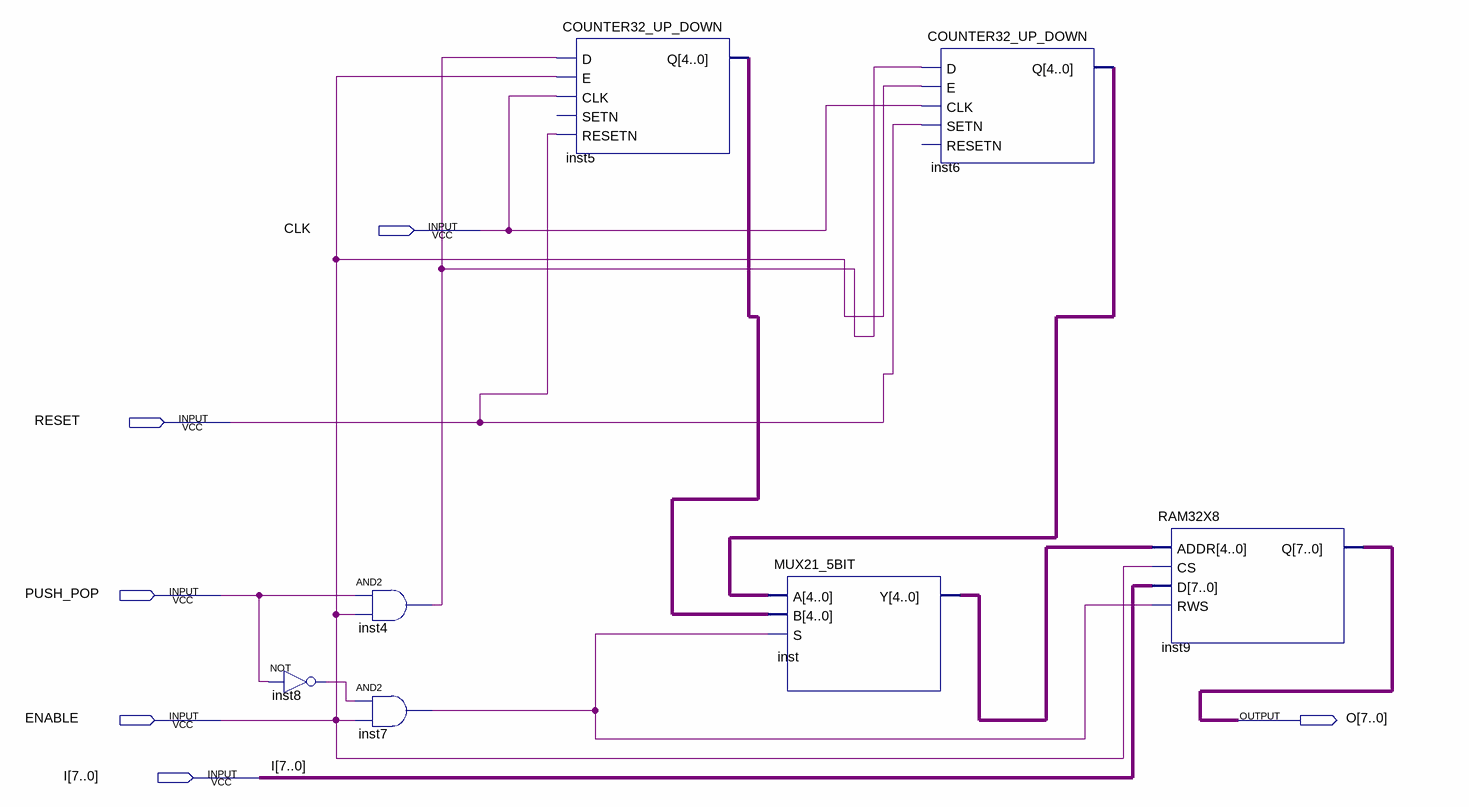
[diagram p0: schematic sheet]
// Quartus schematic STACK_FINAL.bdf as structural Verilog: 7 symbols, 6 pins
module STACK_FINAL (
  input  CLK,
  input  RESET,
  input  PUSH_POP,
  input  ENABLE,
  input  [7:0] I,
  output [7:0] O
);

  wire inst4_out, inst7_out, inst8_out;
  wire [4:0] inst5_q, inst6_q, inst_y;

  not inst8 (inst8_out, PUSH_POP);
  and inst4 (inst4_out, PUSH_POP, ENABLE);
  and inst7 (inst7_out, inst8_out, ENABLE);
  COUNTER32_UP_DOWN inst5 (.D(inst4_out), .E(ENABLE), .CLK(CLK), .RESETN(RESET), .Q(inst5_q));  // open: SETN
  MUX21_5BIT inst (.A(inst6_q), .B(inst5_q), .S(inst7_out), .Y(inst_y));
  COUNTER32_UP_DOWN inst6 (.D(inst4_out), .E(ENABLE), .CLK(CLK), .SETN(RESET), .Q(inst6_q));  // open: RESETN
  RAM32X8 inst9 (.ADDR(inst_y), .CS(ENABLE), .D(I), .RWS(inst7_out), .Q(O));
endmodule
